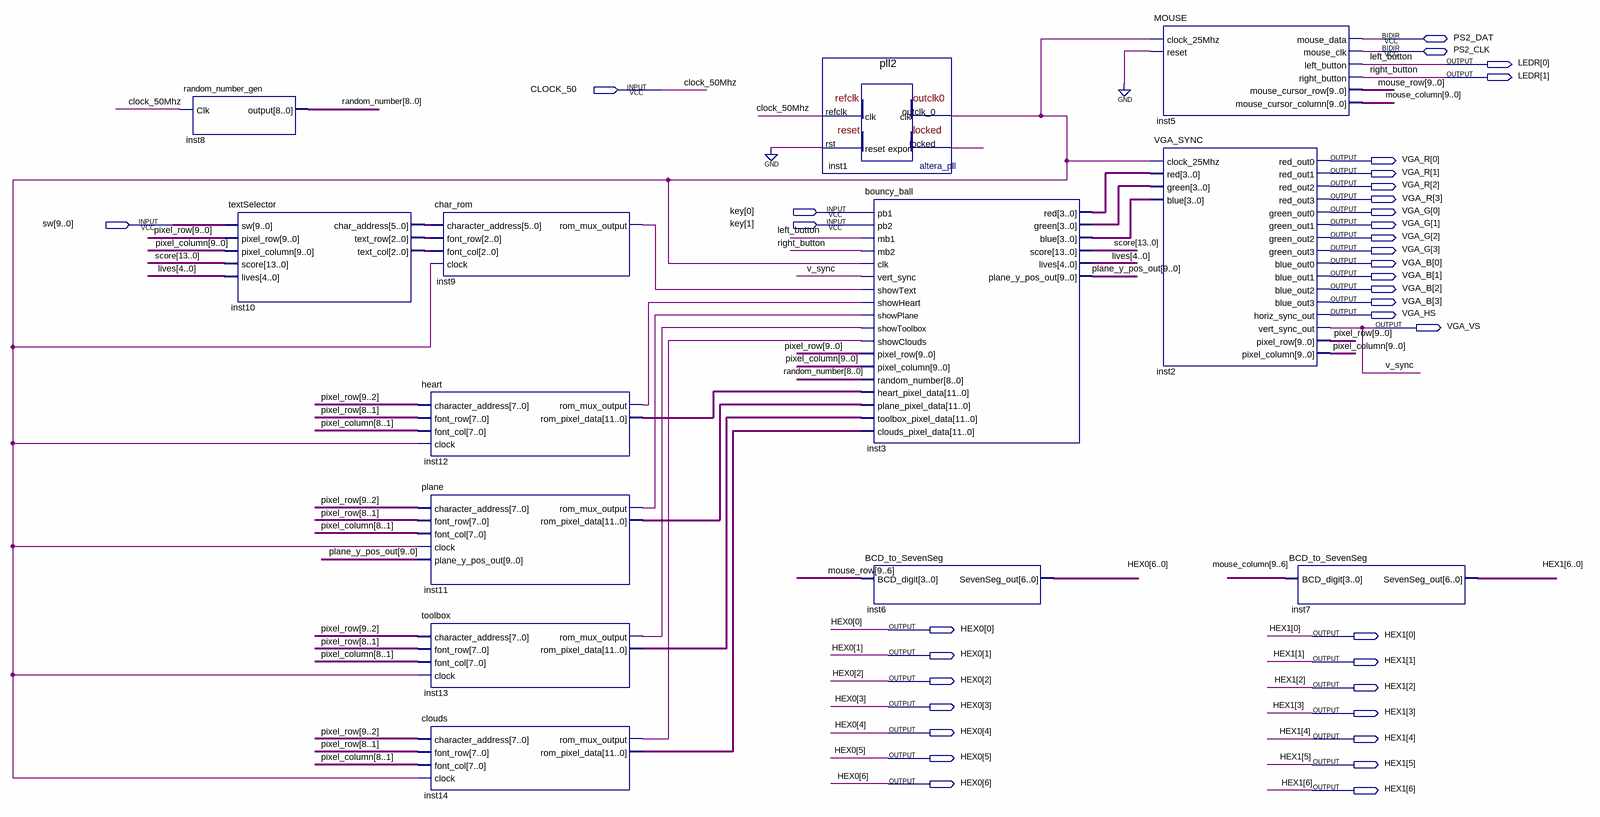
[diagram p0: schematic sheet]
// Quartus schematic toplevel.bdf as structural Verilog: 13 symbols, 36 pins
module toplevel (
  input  CLOCK_50,
  input  [1:0] key,
  input  [9:0] sw,
  inout  PS2_DAT,
  inout  PS2_CLK,
  output [1:0] LEDR,
  output [3:0] VGA_R,
  output [3:0] VGA_G,
  output [3:0] VGA_B,
  output VGA_HS,
  output VGA_VS,
  output [6:0] HEX0,
  output [6:0] HEX1
);

  wire inst1_locked, inst1_outclk_0, inst9_rom_mux_output, inst11_rom_mux_output, inst12_rom_mux_output,
       inst13_rom_mux_output, inst14_rom_mux_output;
  wire [2:0] inst10_text_col, inst10_text_row;
  wire [3:0] inst3_blue, inst3_green, inst3_red;
  wire [4:0] lives;
  wire [5:0] inst10_char_address;
  wire [8:0] random_number;
  wire [9:0] mouse_column, mouse_row, pixel_column, pixel_row, plane_y_pos_out;
  wire [11:0] inst11_rom_pixel_data, inst12_rom_pixel_data, inst13_rom_pixel_data, inst14_rom_pixel_data;
  wire [13:0] score;

  random_number_gen inst8 (.Clk(CLOCK_50), .\output (random_number));
  textSelector inst10 (
    .sw(sw), .pixel_row(pixel_row), .pixel_column(pixel_column), .score(score), .lives(lives),
    .char_address(inst10_char_address), .text_row(inst10_text_row), .text_col(inst10_text_col));
  char_rom inst9 (
    .character_address(inst10_char_address), .font_row(inst10_text_row), .font_col(inst10_text_col),
    .clock(inst1_outclk_0), .rom_mux_output(inst9_rom_mux_output));
  heart inst12 (
    .character_address(pixel_row[9:2]), .font_row(pixel_row[8:1]), .font_col(pixel_column[8:1]),
    .clock(inst1_outclk_0), .rom_mux_output(inst12_rom_mux_output), .rom_pixel_data(inst12_rom_pixel_data));
  plane inst11 (
    .character_address(pixel_row[9:2]), .font_row(pixel_row[8:1]), .font_col(pixel_column[8:1]),
    .clock(inst1_outclk_0), .plane_y_pos_out(plane_y_pos_out), .rom_mux_output(inst11_rom_mux_output),
    .rom_pixel_data(inst11_rom_pixel_data));
  toolbox inst13 (
    .character_address(pixel_row[9:2]), .font_row(pixel_row[8:1]), .font_col(pixel_column[8:1]),
    .clock(inst1_outclk_0), .rom_mux_output(inst13_rom_mux_output), .rom_pixel_data(inst13_rom_pixel_data));
  clouds inst14 (
    .character_address(pixel_row[9:2]), .font_row(pixel_row[8:1]), .font_col(pixel_column[8:1]),
    .clock(inst1_outclk_0), .rom_mux_output(inst14_rom_mux_output), .rom_pixel_data(inst14_rom_pixel_data));
  pll2 inst1 (.refclk(CLOCK_50), .rst(1'b0), .outclk_0(inst1_outclk_0), .locked(inst1_locked));
  bouncy_ball inst3 (
    .pb1(key[0]), .pb2(key[1]), .mb1(LEDR[0]), .mb2(LEDR[1]), .clk(inst1_outclk_0), .vert_sync(VGA_VS),
    .showText(inst9_rom_mux_output), .showHeart(inst12_rom_mux_output), .showPlane(inst11_rom_mux_output),
    .showToolbox(inst13_rom_mux_output), .showClouds(inst14_rom_mux_output), .pixel_row(pixel_row),
    .pixel_column(pixel_column), .random_number(random_number), .heart_pixel_data(inst12_rom_pixel_data),
    .plane_pixel_data(inst11_rom_pixel_data), .toolbox_pixel_data(inst13_rom_pixel_data),
    .clouds_pixel_data(inst14_rom_pixel_data), .red(inst3_red), .green(inst3_green), .blue(inst3_blue),
    .score(score), .lives(lives), .plane_y_pos_out(plane_y_pos_out));
  BCD_to_SevenSeg inst6 (.BCD_digit(mouse_row[9:6]), .SevenSeg_out(HEX0));
  MOUSE inst5 (
    .clock_25Mhz(inst1_outclk_0), .reset(1'b0), .left_button(LEDR[0]), .right_button(LEDR[1]),
    .mouse_cursor_row(mouse_row), .mouse_cursor_column(mouse_column), .mouse_data(PS2_DAT),
    .mouse_clk(PS2_CLK));
  VGA_SYNC inst2 (
    .clock_25Mhz(inst1_outclk_0), .red(inst3_red), .green(inst3_green), .blue(inst3_blue),
    .red_out0(VGA_R[0]), .red_out1(VGA_R[1]), .red_out2(VGA_R[2]), .red_out3(VGA_R[3]),
    .green_out0(VGA_G[0]), .green_out1(VGA_G[1]), .green_out2(VGA_G[2]), .green_out3(VGA_G[3]),
    .blue_out0(VGA_B[0]), .blue_out1(VGA_B[1]), .blue_out2(VGA_B[2]), .blue_out3(VGA_B[3]),
    .horiz_sync_out(VGA_HS), .vert_sync_out(VGA_VS), .pixel_row(pixel_row), .pixel_column(pixel_column));
  BCD_to_SevenSeg inst7 (.BCD_digit(mouse_column[9:6]), .SevenSeg_out(HEX1));

  // Other names for the same wires on the sheet: clock_50Mhz = CLOCK_50; left_button = LEDR[0];
  //   right_button = LEDR[1]; v_sync = VGA_VS
endmodule
